# EAGLE schematic 2_auto (EAGLE 5.10)
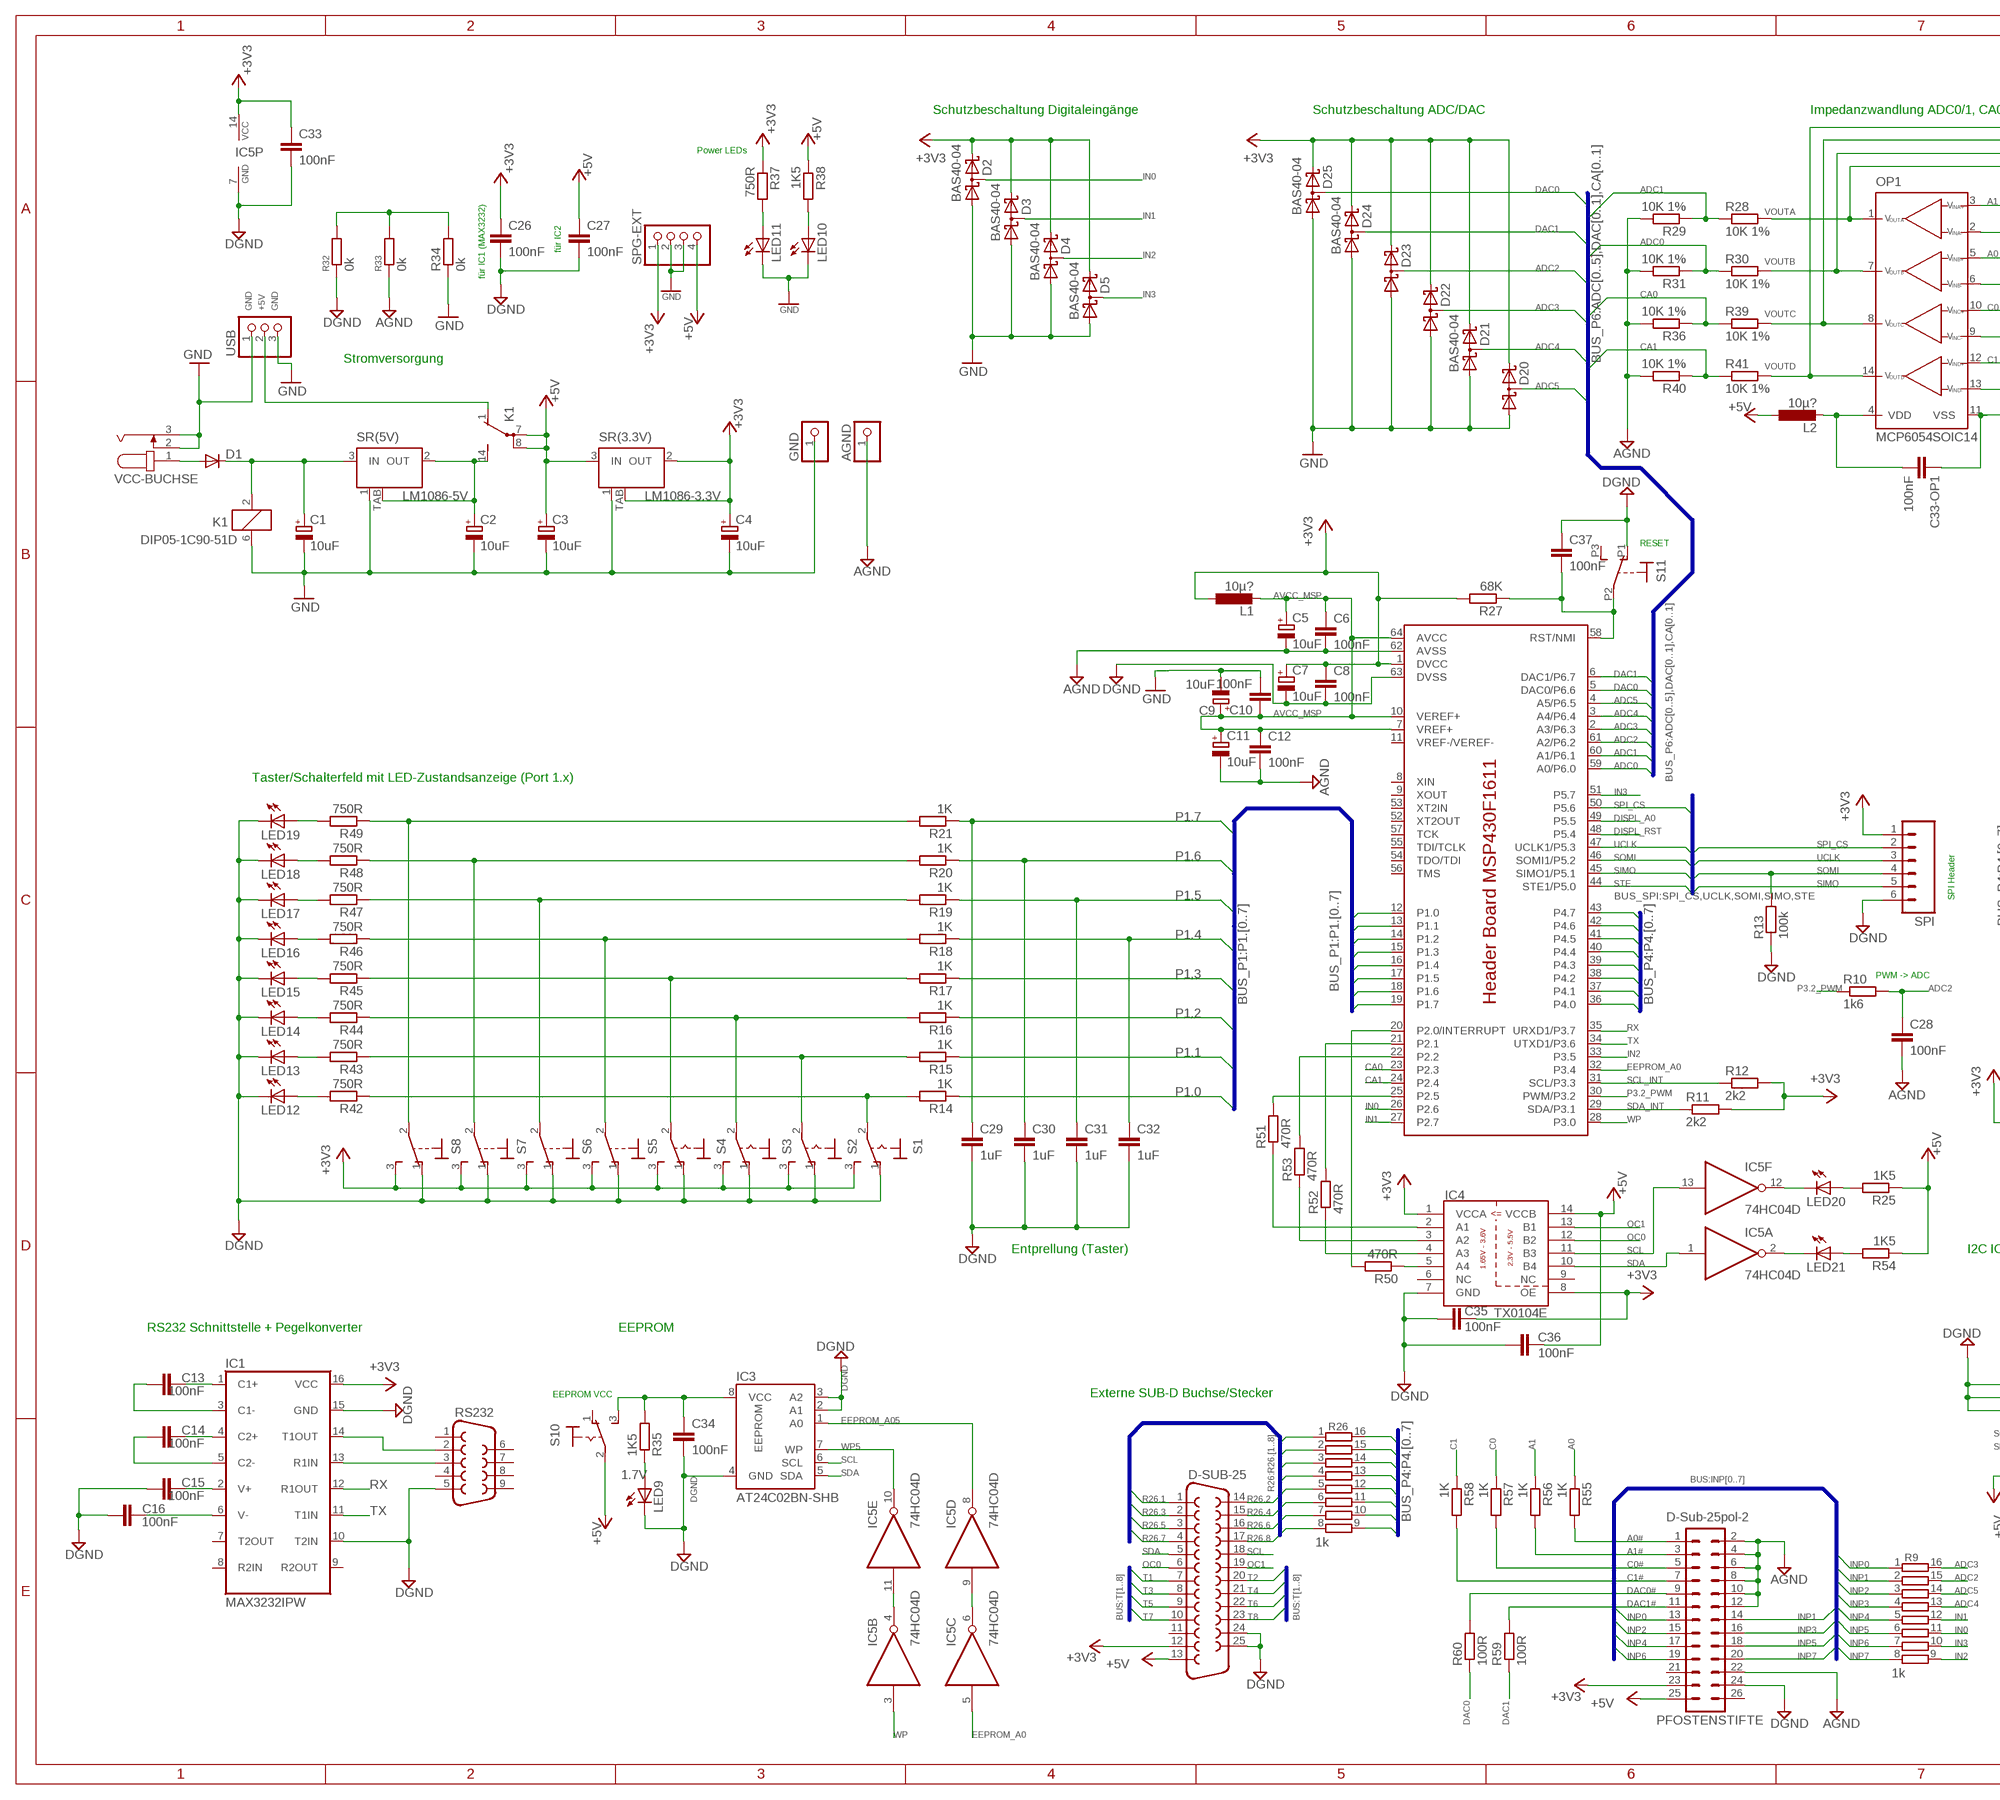
[diagram p0: schematic, sheet 1, part 1 of 2]
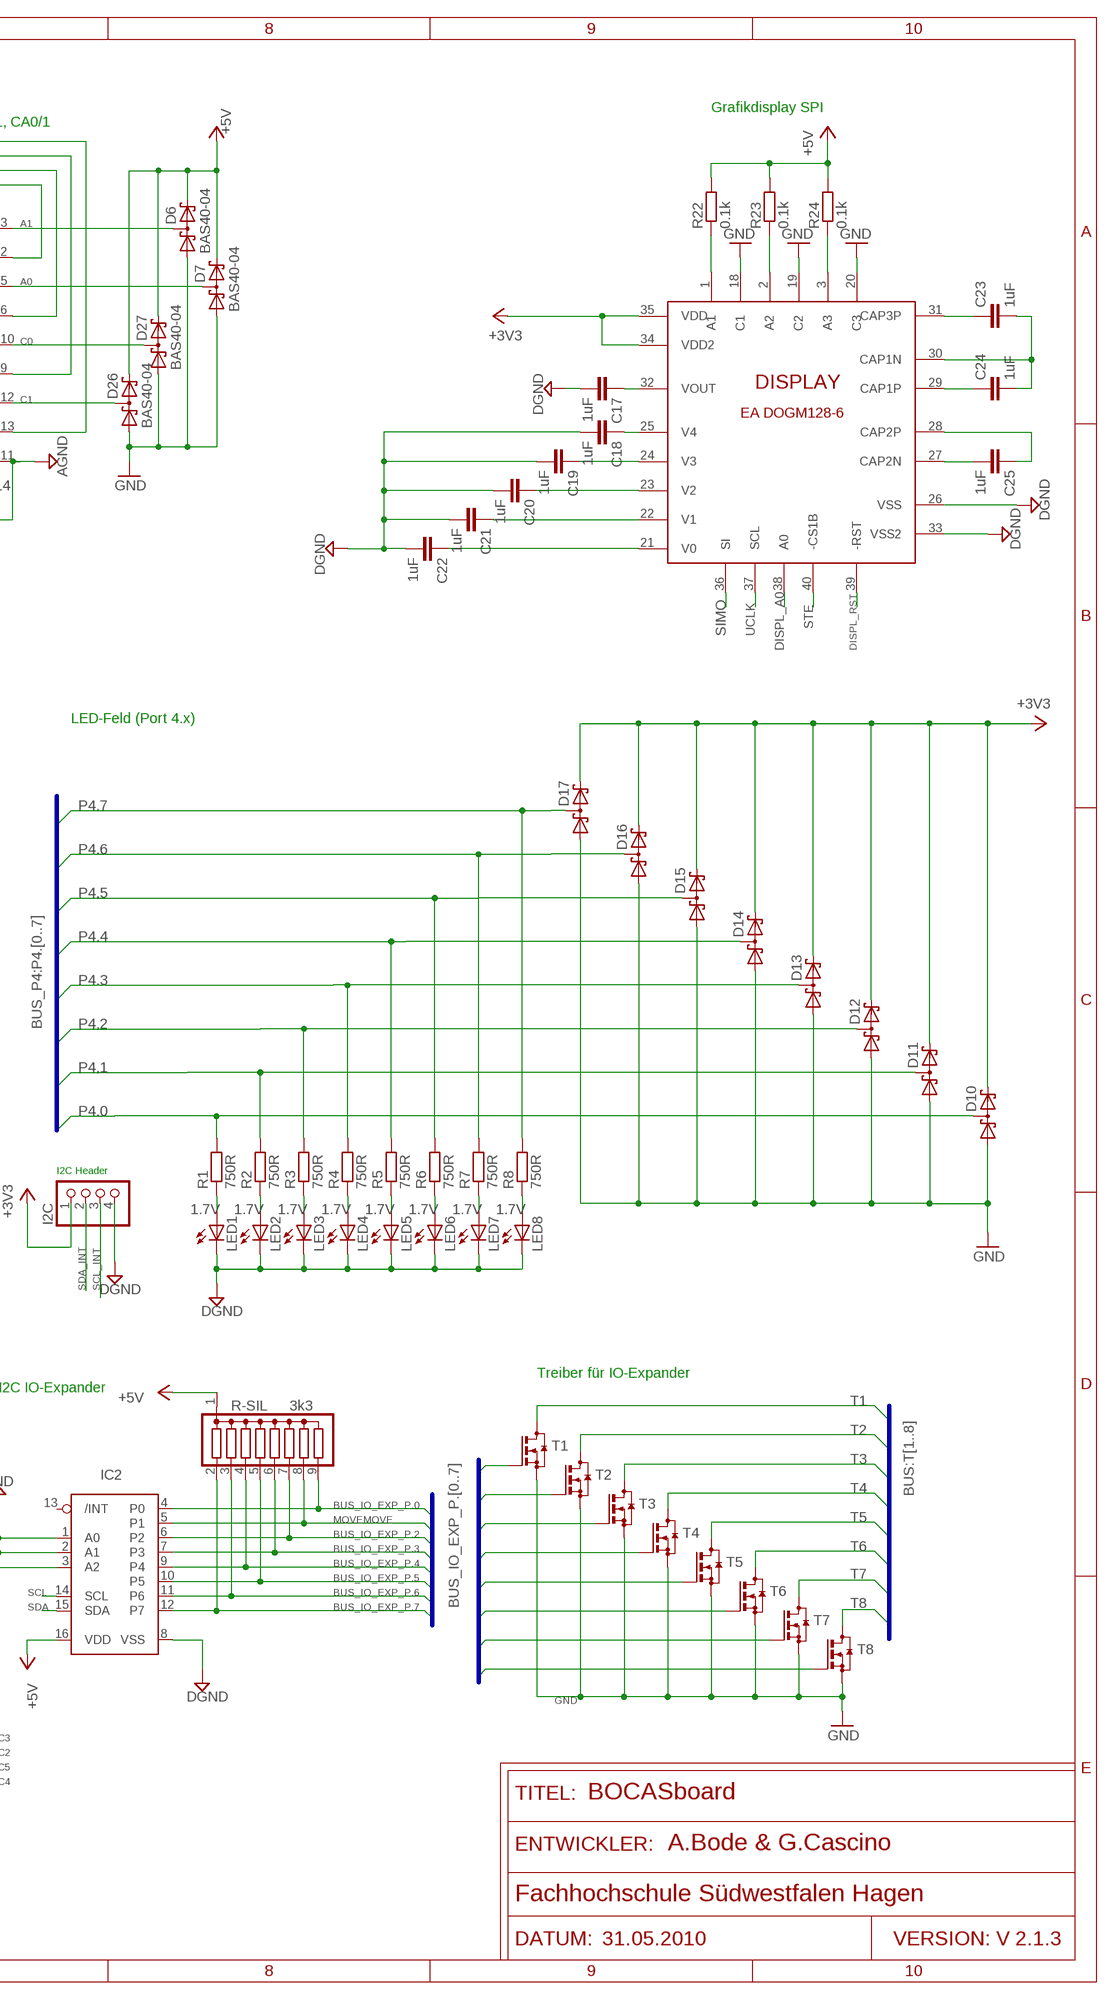
[diagram p1: schematic, sheet 1, part 2 of 2]

## Parts
AGND  PINHD-1X1  [1X01]
C1  10uF  KONDENSATORENCT3216  [CT3216]
C2  10uF  KONDENSATORENCT3216  [CT3216]
C3  10uF  KONDENSATORENCT3216  [CT3216]
C4  10uF  KONDENSATORENCT3216  [CT3216]
C5  10uF  KONDENSATORENCT3216  [CT3216]
C6  100nF  KONDENSATOR-  [R0805]
C7  10uF  KONDENSATORENCT3216  [CT3216]
C8  100nF  KONDENSATOR-  [R0805]
C9  10uF  KONDENSATORENCT3216  [CT3216]
C10  100nF  KONDENSATOR-  [R0805]
C11  10uF  KONDENSATORENCT3216  [CT3216]
C12  100nF  KONDENSATOR-  [R0805]
C13  100nF  KONDENSATOREN-KERAMIK  [C0805]
C14  100nF  KONDENSATOREN-KERAMIK  [C0805]
C15  100nF  KONDENSATOREN-KERAMIK  [C0805]
C16  100nF  KONDENSATOREN-KERAMIK  [C0805]
C17  1uF  KONDENSATOREN-KERAMIK  [C0805]
C18  1uF  KONDENSATOREN-KERAMIK  [C0805]
C19  1uF  KONDENSATOREN-KERAMIK  [C0805]
C20  1uF  KONDENSATOREN-KERAMIK  [C0805]
C21  1uF  KONDENSATOREN-KERAMIK  [C0805]
C22  1uF  KONDENSATOREN-KERAMIK  [C0805]
C23  1uF  KONDENSATOREN-KERAMIK  [C0805]
C24  1uF  KONDENSATOREN-KERAMIK  [C0805]
C25  1uF  KONDENSATOREN-KERAMIK  [C0805]
C26  100nF  KONDENSATOREN-KERAMIK  [C0805]
C27  100nF  KONDENSATOREN-KERAMIK  [C0805]
C28  100nF  KONDENSATOREN-KERAMIK  [C0805]
C29  1uF  KONDENSATOREN-KERAMIK  [C0805]
C30  1uF  KONDENSATOREN-KERAMIK  [C0805]
C31  1uF  KONDENSATOREN-KERAMIK  [C0805]
C32  1uF  KONDENSATOREN-KERAMIK  [C0805]
C33  100nF  KONDENSATOREN-KERAMIK  [C0805]
C33-OP1  100nF  KONDENSATOREN-KERAMIK  [C0805]
C34  100nF  KONDENSATOREN-KERAMIK  [C0805]
C35  100nF  KONDENSATOREN-KERAMIK  [C0805]
C36  100nF  KONDENSATOREN-KERAMIK  [C0805]
C37  100nF  KONDENSATOR-  [R0805]
D1  ES2D  [SMB]
D2  BAS40-04  [SOT23]
D3  BAS40-04  [SOT23]
D4  BAS40-04  [SOT23]
D5  BAS40-04  [SOT23]
D6  BAS40-04  [SOT23]
D7  BAS40-04  [SOT23]
D10  BAS40-04  [SOT23]
D11  BAS40-04  [SOT23]
D12  BAS40-04  [SOT23]
D13  BAS40-04  [SOT23]
D14  BAS40-04  [SOT23]
D15  BAS40-04  [SOT23]
D16  BAS40-04  [SOT23]
D17  BAS40-04  [SOT23]
D20  BAS40-04  [SOT23]
D21  BAS40-04  [SOT23]
D22  BAS40-04  [SOT23]
D23  BAS40-04  [SOT23]
D24  BAS40-04  [SOT23]
D25  BAS40-04  [SOT23]
D26  BAS40-04  [SOT23]
D27  BAS40-04  [SOT23]
D-SUB-25  D-SUB-25H  [F25-HORIZONTAL_2]
DISPLAY  EADOGM128  [EADOGM128]
GND  PINHD-1X1  [1X01]
I2C  PINHD-1X4  [1X04]
IC1  MAX3232IPW  [TSSOP16]
IC2  PCF8574AT  [SO16L]
IC3  AT24C02BN-SHB  [SOIC8]
IC4  TX0104E  TX0104PWR  [TSSOP14]
IC5  74HC04D  [SO14]
K1  DIP05-1C90-51D  [RR1U]
L1  10µ?  L-EUL0805  [R0805]
L2  10µ?  L-EUL0805  [R0805]
LED1  1.7V  LED3MM  [LED3MM]
LED2  1.7V  LED3MM  [LED3MM]
LED3  1.7V  LED3MM  [LED3MM]
LED4  1.7V  LED3MM  [LED3MM]
LED5  1.7V  LED3MM  [LED3MM]
LED6  1.7V  LED3MM  [LED3MM]
LED7  1.7V  LED3MM  [LED3MM]
LED8  1.7V  LED3MM  [LED3MM]
LED9  1.7V  LED3MM  [LED3MM]
LED10  LED  [R0805]
LED11  LED  [R0805]
LED12  LED  [R0805]
LED13  LED  [R0805]
LED14  LED  [R0805]
LED15  LED  [R0805]
LED16  LED  [R0805]
LED17  LED  [R0805]
LED18  LED  [R0805]
LED19  LED  [R0805]
LED20  LED  [R0805]
LED21  LED  [R0805]
OP1  MCP6054SOIC14  [SO14]
PFOSTENSTIFTE  D-Sub-25pol-2  PFOSTENSTIFTE  [ML26]
R1  750R  WIDERSTÄNDE_R0805  [R0805]
R2  750R  WIDERSTÄNDE_R0805  [R0805]
R3  750R  WIDERSTÄNDE_R0805  [R0805]
R4  750R  WIDERSTÄNDE_R0805  [R0805]
R5  750R  WIDERSTÄNDE_R0805  [R0805]
R6  750R  WIDERSTÄNDE_R0805  [R0805]
R7  750R  WIDERSTÄNDE_R0805  [R0805]
R8  750R  WIDERSTÄNDE_R0805  [R0805]
R9  1k  4816P-NETF  [SO16-F]
R10  1k6  WIDERSTÄNDE_R0805  [R0805]
R11  2k2  WIDERSTÄNDE_R0805  [R0805]
R12  2k2  WIDERSTÄNDE_R0805  [R0805]
R13  100k  WIDERSTÄNDE_R0805  [R0805]
R14  1K  WIDERSTÄNDE_R0805  [R0805]
R15  1K  WIDERSTÄNDE_R0805  [R0805]
R16  1K  WIDERSTÄNDE_R0805  [R0805]
R17  1K  WIDERSTÄNDE_R0805  [R0805]
R18  1K  WIDERSTÄNDE_R0805  [R0805]
R19  1K  WIDERSTÄNDE_R0805  [R0805]
R20  1K  WIDERSTÄNDE_R0805  [R0805]
R21  1K  WIDERSTÄNDE_R0805  [R0805]
R22  0.1k  WIDERSTÄNDE_R0805  [R0805]
R23  0.1k  WIDERSTÄNDE_R0805  [R0805]
R24  0.1k  WIDERSTÄNDE_R0805  [R0805]
R25  1K5  WIDERSTÄNDE_R0805  [R0805]
R26  1k  4816P-NETF  [SO16-F]
R27  68K  WIDERSTÄNDE_M0805  [M0805]
R28  10K 1%  WIDERSTÄNDE_R0805  [R0805]
R29  10K 1%  WIDERSTÄNDE_R0805  [R0805]
R30  10K 1%  WIDERSTÄNDE_R0805  [R0805]
R31  10K 1%  WIDERSTÄNDE_R0805  [R0805]
R32  0k  WIDERSTÄNDE_R0805  [R0805]
R33  0k  WIDERSTÄNDE_R0805  [R0805]
R34  0k  WIDERSTÄNDE_R0805  [R0805]
R35  1K5  WIDERSTÄNDE_R0805  [R0805]
R36  10K 1%  WIDERSTÄNDE_R0805  [R0805]
R37  750R  WIDERSTÄNDE_M0805  [M0805]
R38  1K5  WIDERSTÄNDE_M0805  [M0805]
R39  10K 1%  WIDERSTÄNDE_R0805  [R0805]
R40  10K 1%  WIDERSTÄNDE_R0805  [R0805]
R41  10K 1%  WIDERSTÄNDE_R0805  [R0805]
R42  750R  WIDERSTÄNDE_R0805  [R0805]
R43  750R  WIDERSTÄNDE_R0805  [R0805]
R44  750R  WIDERSTÄNDE_R0805  [R0805]
R45  750R  WIDERSTÄNDE_R0805  [R0805]
R46  750R  WIDERSTÄNDE_R0805  [R0805]
R47  750R  WIDERSTÄNDE_R0805  [R0805]
R48  750R  WIDERSTÄNDE_R0805  [R0805]
R49  750R  WIDERSTÄNDE_R0805  [R0805]
R50  470R  WIDERSTÄNDE_R0805  [R0805]
R51  470R  WIDERSTÄNDE_R0805  [R0805]
R52  470R  WIDERSTÄNDE_R0805  [R0805]
R53  470R  WIDERSTÄNDE_R0805  [R0805]
R54  1K5  WIDERSTÄNDE_R0805  [R0805]
R55  1K  WIDERSTÄNDE_R0805  [R0805]
R56  1K  WIDERSTÄNDE_R0805  [R0805]
R57  1K  WIDERSTÄNDE_R0805  [R0805]
R58  1K  WIDERSTÄNDE_R0805  [R0805]
R59  100R  WIDERSTÄNDE_R0805  [R0805]
R60  100R  WIDERSTÄNDE_R0805  [R0805]
R-SIL  3k3  BOURNS-4609  [SIL9]
RS232  D-SUB-09H  [F09-H1]
S1  KIPPSCHALTER  [2MS]
S2  KIPPSCHALTER  [2MS]
S3  KIPPSCHALTER  [2MS]
S4  KIPPSCHALTER  [2MS]
S5  KIPPTASTER  [2MS]
S6  KIPPTASTER  [2MS]
S7  KIPPTASTER  [2MS]
S8  KIPPTASTER  [2MS]
S10  KIPPSCHALTER  [2MS]
S11  RESET-KIPPTASTER  [KIPPTASTER-90]
SPG-EXT  PINHD-1X4  [1X04]
SPI  PFOSTENSTECKER-P06  [PFOSTENSTECKER-P06]
SR(3.3V)  LM1086-3.3V  [TO263-3]
SR(5V)  LM1086-5V  [TO263-3]
T1  N-MOSFET  [SOT346]
T2  N-MOSFET  [SOT346]
T3  N-MOSFET  [SOT346]
T4  N-MOSFET  [SOT346]
T5  N-MOSFET  [SOT346]
T6  N-MOSFET  [SOT346]
T7  N-MOSFET  [SOT346]
T8  N-MOSFET  [SOT346]
U$1  HEADER_BOARD_2  [MCKU]
USB  PINHD-1X3  [1X03]
VCC-BUCHSE  VCC-BUCHSE0  [VCC-BUCHSE-MULTIOCOMP]

## Nets
+3V3 [VCC +3.3V]: C4.+ C7.+ C8.1 C26.1 C33.1 C35.1 D2.2(C2) D3.2(C2) D4.2(C2) D5.2(C2) D10.2(C2) D11.2(C2) D12.2(C2) D13.2(C2) D14.2(C2) D15.2(C2) D16.2(C2) D17.2(C2) D20.2(C2) D21.2(C2) D22.2(C2) D23.2(C2) D24.2(C2) D25.2(C2) D-SUB-25.12 DISPLAY.34(VDD2) DISPLAY.35(VDD) I2C.1 IC1.16(VCC) IC4.1(VCCA) IC4.8(OE) IC5.14(P:VCC) L1.1 PFOSTENSTIFTE.23 R11.2 R12.2 R27.2 R37.1 S1.3 S2.3 S3.3 S4.3 S5.3 S6.3 S7.3 S8.3 SPG-EXT.1 SPI.1 SR(3.3V).2(OUT) SR(3.3V).TAB(OUT) U$1.1(DVCC)
+5V [Power]: C3.+ C27.1 C36.1 D6.2(C2) D7.2(C2) D26.2(C2) D27.2(C2) D-SUB-25.13 IC2.16(VDD) IC4.14(VCCB) K1.7(2:P) K1.8(2:P) L2.1 PFOSTENSTIFTE.25 R22.2 R23.2 R24.2 R25.1 R38.1 R54.1 R-SIL.1 S10.2 SPG-EXT.4 SR(3.3V).3(IN)
A0 [Analog]: D7.3(C1A2) OP1.5(VINB+) R55.1
A0# [Analog]: PFOSTENSTIFTE.1 R55.2
A1 [Analog]: D6.3(C1A2) OP1.3(VINA+) R56.1
A1# [Analog]: PFOSTENSTIFTE.3 R56.2
A2_TX: IC4.4(A3) R52.1
A3_TX: IC4.3(A2) R53.1
A4_TX: IC4.2(A1) R51.1
ADC0: R30.1 R31.1 U$1.59(A0/P6.0)
ADC1: R28.1 R29.1 U$1.60(A1/P6.1)
ADC2 [Analog]: C28.1 D23.3(C1A2) R9.15 R10.2 U$1.61(A2/P6.2)
ADC3 [Analog]: D22.3(C1A2) R9.16 U$1.2(A3/P6.3)
ADC4 [Analog]: D21.3(C1A2) R9.13 U$1.3(A4/P6.4)
ADC5 [Analog]: D20.3(C1A2) R9.14 U$1.4(A5/P6.5)
AGND [Power]: AGND.1 C5.- C6.2 C11.- C12.2 C28.2 C33-OP1.1 OP1.11(VSS) PFOSTENSTIFTE.2 PFOSTENSTIFTE.4 PFOSTENSTIFTE.6 PFOSTENSTIFTE.8 PFOSTENSTIFTE.10 PFOSTENSTIFTE.12 PFOSTENSTIFTE.22 R29.2 R31.2 R33.1 R36.2 R40.2 U$1.62(AVSS)
AVCC_MSP [VCC +3.3V]: C5.+ C6.1 C9.+ C10.1 C11.+ C12.1 L1.2 U$1.7(VREF+) U$1.10(VEREF+) U$1.64(AVCC)
BUS_IO_EXP_P.0 [Digital]: IC2.4(P0) R-SIL.9 T1.1(G)
BUS_IO_EXP_P.2 [Digital]: IC2.6(P2) R-SIL.7 T3.1(G)
BUS_IO_EXP_P.3 [Digital]: IC2.7(P3) R-SIL.6 T4.1(G)
BUS_IO_EXP_P.4 [Digital]: IC2.9(P4) R-SIL.4 T5.1(G)
BUS_IO_EXP_P.5 [Digital]: IC2.10(P5) R-SIL.5 T6.1(G)
BUS_IO_EXP_P.6: IC2.11(P6) R-SIL.3 T7.1(G)
BUS_IO_EXP_P.7 [Digital]: IC2.12(P7) R-SIL.2 T8.1(G)
C0: D27.3(C1A2) OP1.10(VINC+) R57.1
C0#: PFOSTENSTIFTE.5 R57.2
C1: D26.3(C1A2) OP1.12(VIND+) R58.1
C1#: PFOSTENSTIFTE.7 R58.2
C1+: C13.2 IC1.1(C1+)
C1-: C13.1 IC1.3(C1-)
C2+: C14.2 IC1.4(C2+)
CA0: R36.1 R39.1 U$1.23(P2.3)
CA1: R40.1 R41.1 U$1.24(P2.4)
DAC0: D25.3(C1A2) R60.1 U$1.5(DAC0/P6.6)
DAC0#: PFOSTENSTIFTE.9 R60.2
DAC1: D24.3(C1A2) R59.1 U$1.6(DAC1/P6.7)
DAC1#: PFOSTENSTIFTE.11 R59.2
DGND [Digital]: C7.- C8.2 C15.1 C16.1 C17.2 C18.2 C19.2 C20.2 C21.2 C22.2 C26.2 C27.2 C29.2 C30.2 C31.2 C32.2 C33.2 C34.2 C35.2 C36.2 C37.1 D-SUB-25.24 D-SUB-25.25 DISPLAY.26(VSS) DISPLAY.33(VSS2) I2C.4 IC1.10(T2IN) IC1.15(GND) IC2.1(A0) IC2.2(A1) IC2.3(A2) IC2.8(VSS) IC3.2(A1) IC3.3(A2) IC3.4(GND) IC4.7(GND) IC5.7(P:GND) LED1.K LED2.K LED3.K LED4.K LED5.K LED6.K LED7.K LED8.K LED9.K LED12.2(K) LED13.2(K) LED14.2(K) LED15.2(K) LED16.2(K) LED17.2(K) LED18.2(K) LED19.2(K) PFOSTENSTIFTE.24 R13.1 R32.1 RS232.5 S1.1 S2.1 S3.1 S4.1 S5.1 S6.1 S7.1 S8.1 S11.P1 SPI.6 U$1.63(DVSS)
DISPL_A0 [Digital]: DISPLAY.38(A0) U$1.49(P5.5)
DISPL_RST [Digital]: DISPLAY.39(-RST) U$1.48(P5.4)
EEPROM_A0 [Digital]: IC5.5(C:I) U$1.32(P3.4)
EEPROM_A05 [Digital]: IC3.1(A0) IC5.8(D:O)
GND [High Strom]: C1.- C2.- C3.- C4.- C9.- C10.2 D2.1(A1) D3.1(A1) D4.1(A1) D5.1(A1) D6.1(A1) D7.1(A1) D10.1(A1) D11.1(A1) D12.1(A1) D13.1(A1) D14.1(A1) D15.1(A1) D16.1(A1) D17.1(A1) D20.1(A1) D21.1(A1) D22.1(A1) D23.1(A1) D24.1(A1) D25.1(A1) D26.1(A1) D27.1(A1) DISPLAY.18(C1) DISPLAY.19(C2) DISPLAY.20(C3) GND.1 K1.6 LED10.2(K) LED11.2(K) R34.1 SPG-EXT.2 SPG-EXT.3 SR(3.3V).1(GND) SR(5V).1(GND) T1.2(S) T2.2(S) T3.2(S) T4.2(S) T5.2(S) T6.2(S) T7.2(S) T8.2(S) USB.1 USB.3 VCC-BUCHSE.2 VCC-BUCHSE.3
IN0: D2.3(C1A2) R9.11 U$1.26(P2.6)
IN1: D3.3(C1A2) R9.12 U$1.27(P2.7)
IN2: D4.3(C1A2) R9.9 U$1.33(P3.5)
IN3: D5.3(C1A2) R9.10 U$1.51(P5.7)
INP0: PFOSTENSTIFTE.13 R9.1
INP1: PFOSTENSTIFTE.14 R9.2
INP2: PFOSTENSTIFTE.15 R9.3
INP3: PFOSTENSTIFTE.16 R9.4
INP4: PFOSTENSTIFTE.17 R9.5
INP5: PFOSTENSTIFTE.18 R9.6
INP6: PFOSTENSTIFTE.19 R9.7
INP7: PFOSTENSTIFTE.20 R9.8
MOVEMOVE [Digital]: IC2.5(P1) R-SIL.8 T2.1(G)
N$1: DISPLAY.1(A1) R22.1
N$2: R14.2 R42.1 S1.2
N$3: LED12.1(A) R42.2
N$4: DISPLAY.2(A2) R23.1
N$5: R50.2 U$1.20(P2.0/INTERRUPT)
N$6: LED19.1(A) R49.2
N$7: DISPLAY.3(A3) R24.1
N$8: LED18.1(A) R48.2
N$9: C23.1 DISPLAY.31(CAP3P)
N$10: LED17.1(A) R47.2
N$11: LED11.1(A) R37.2
N$12: LED10.1(A) R38.2
N$13: LED16.1(A) R46.2
N$14: LED15.1(A) R45.2
N$15: LED14.1(A) R44.2
N$16: C14.1 IC1.5(C2-)
N$17: D1.A VCC-BUCHSE.1
N$18: LED13.1(A) R43.2
N$19: R21.2 R49.1 S8.2
N$20: R20.2 R48.1 S7.2
N$21: R19.2 R47.1 S6.2
N$22: R18.2 R46.1 S5.2
N$23: C22.1 DISPLAY.21(V0)
N$24: C21.1 DISPLAY.22(V1)
N$25: C20.1 DISPLAY.23(V2)
N$26: C19.1 DISPLAY.24(V3)
N$27: LED1.A R1.1
N$28: LED2.A R2.1
N$29: LED3.A R3.1
N$30: LED4.A R4.1
N$31: LED5.A R5.1
N$32: LED6.A R6.1
N$33: LED7.A R7.1
N$34: LED8.A R8.1
N$35: C17.1 DISPLAY.32(VOUT)
N$36: C18.1 DISPLAY.25(V4)
N$37: C24.1 DISPLAY.29(CAP1P)
N$38: C23.2 C24.2 DISPLAY.30(CAP1N)
N$39: C25.2 DISPLAY.27(CAP2N)
N$40: C25.1 DISPLAY.28(CAP2P)
N$41: R17.2 R45.1 S4.2
N$42: R32.2 R33.2 R34.2
N$43: LED9.A R35.1
N$44: R16.2 R44.1 S3.2
N$45: R15.2 R43.1 S2.2
N$46: R52.2 U$1.21(P2.1)
N$47: IC4.5(A4) R50.1
N$48: R51.2 U$1.25(P2.5)
N$50: C15.2 IC1.2(V+)
N$51 [Power]: C33-OP1.2 L2.2 OP1.4(VDD)
N$53: R53.2 U$1.22(P2.2)
N$55: IC5.12(F:O) LED20.2(K)
N$56: IC5.2(A:O) LED21.2(K)
N$57: LED21.1(A) R54.2
N$58: LED20.1(A) R25.2
N$59: IC5.6(C:O) IC5.9(D:I)
N$61: IC5.4(B:O) IC5.11(E:I)
OC0: D-SUB-25.6 IC4.12(B2)
OC1: D-SUB-25.19 IC4.13(B1)
OUT+5V [Power]: C2.+ K1.14(2:S) SR(5V).2(OUT) SR(5V).TAB(OUT)
P1.0 [Digital]: R14.1 U$1.12(P1.0)
P1.1 [Digital]: R15.1 U$1.13(P1.1)
P1.2 [Digital]: R16.1 U$1.14(P1.2)
P1.3 [Digital]: R17.1 U$1.15(P1.3)
P1.4 [Digital]: C32.1 R18.1 U$1.16(P1.4)
P1.5 [Digital]: C31.1 R19.1 U$1.17(P1.5)
P1.6 [Digital]: C30.1 R20.1 U$1.18(P1.6)
P1.7 [Digital]: C29.1 R21.1 U$1.19(P1.7)
P3.2_PWM [Digital]: R10.1 U$1.30(PWM/P3.2)
P4.0 [Digital]: D10.3(C1A2) R1.2 R26.16 U$1.36(P4.0)
P4.1 [Digital]: D11.3(C1A2) R2.2 R26.15 U$1.37(P4.1)
P4.2 [Digital]: D12.3(C1A2) R3.2 R26.14 U$1.38(P4.2)
P4.3 [Digital]: D13.3(C1A2) R4.2 R26.13 U$1.39(P4.3)
P4.4 [Digital]: D14.3(C1A2) R5.2 R26.12 U$1.40(P4.4)
P4.5 [Digital]: D15.3(C1A2) R6.2 R26.11 U$1.41(P4.5)
P4.6 [Digital]: D16.3(C1A2) R7.2 R26.10 U$1.42(P4.6)
P4.7 [Digital]: D17.3(C1A2) R8.2 R26.9 U$1.43(P4.7)
PWR-5 [Power]: C1.+ D1.C K1.2 SR(5V).3(IN)
R1IN [Digital]: IC1.13(R1IN) RS232.3
R26.1: D-SUB-25.1 R26.1
R26.2: D-SUB-25.14 R26.2
R26.3: D-SUB-25.2 R26.3
R26.4: D-SUB-25.15 R26.4
R26.5: D-SUB-25.3 R26.5
R26.6: D-SUB-25.16 R26.6
R26.7: D-SUB-25.4 R26.7
R26.8: D-SUB-25.17 R26.8
RX [Digital]: IC1.12(R1OUT) U$1.35(URXD1/P3.7)
S10: C37.2 R27.1 S11.P2 U$1.58(RST/NMI)
SCL [Digital]: D-SUB-25.18 IC2.14(SCL) IC3.6(SCL) IC4.11(B3) IC5.13(F:I)
SCL_INT [Digital]: I2C.3 R12.1 U$1.31(SCL/P3.3)
SDA [Digital]: D-SUB-25.5 IC2.15(SDA) IC3.5(SDA) IC4.10(B4) IC5.1(A:I)
SDA_INT [Digital]: I2C.2 R11.1 U$1.29(SDA/P3.1)
SIMO: DISPLAY.36(SI) SPI.5 U$1.45(SIMO1/P5.1)
SOMI: R13.2 SPI.4 U$1.46(SOMI1/P5.2)
SPI_CS: SPI.2 U$1.50(P5.6)
STE: DISPLAY.40(-CS1B) U$1.44(STE1/P5.0)
T1 [High Strom]: D-SUB-25.7 T1.3(D)
T1OUT [Digital]: IC1.14(T1OUT) RS232.2
T2 [High Strom]: D-SUB-25.20 T2.3(D)
T3 [High Strom]: D-SUB-25.8 T3.3(D)
T4 [High Strom]: D-SUB-25.21 T4.3(D)
T5 [High Strom]: D-SUB-25.9 T5.3(D)
T6 [High Strom]: D-SUB-25.22 T6.3(D)
T7 [High Strom]: D-SUB-25.10 T7.3(D)
T8 [High Strom]: D-SUB-25.23 T8.3(D)
TX [Digital]: IC1.11(T1IN) U$1.34(UTXD1/P3.6)
UCLK: DISPLAY.37(SCL) SPI.3 U$1.47(UCLK1/P5.3)
USB [Power]: K1.1(2:O) USB.2
V-: C16.2 IC1.6(V-)
VCC-EEPROM [Digital]: C34.1 IC3.8(VCC) R35.2 S10.3
VOUTA: OP1.1(VOUTA) OP1.2(VINA-) R28.2
VOUTB: OP1.6(VINB-) OP1.7(VOUTB) R30.2
VOUTC: OP1.8(VOUTC) OP1.9(VINC-) R39.2
VOUTD: OP1.13(VIND-) OP1.14(VOUTD) R41.2
WP [Digital]: IC5.3(B:I) U$1.28(P3.0)
WP5 [Digital]: IC3.7(WP) IC5.10(E:O)
Unconnected: D-SUB-25.11 IC1.7(T2OUT) IC1.8(R2IN) IC1.9(R2OUT) IC2.13(/INT) IC4.6(NC) IC4.9(NC) PFOSTENSTIFTE.21 PFOSTENSTIFTE.26 RS232.1 RS232.4 RS232.6 RS232.7 RS232.8 RS232.9 S10.1 S11.P3 U$1.8(XIN) U$1.9(XOUT) U$1.11(VREF-/VEREF-) U$1.52(XT2OUT) U$1.53(XT2IN) U$1.54(TDO/TDI) U$1.55(TDI/TCLK) U$1.56(TMS) U$1.57(TCK)

## Buses
BUS_P1:P1.[0..7]
BUS_IO_EXP_P.[0..7]
BUS_SPI:SPI_CS,UCLK,SOMI,SIMO,STE
BUS:T[1..8]
R26:R26.[1..8]
BUS_P4:P4.[0..7]
BUS_P6:ADC[0..5],DAC[0..1],CA[0..1]
BUS:INP[0..7]

## Notes on the sheet
- Grafikdisplay SPI
- Schutzbeschaltung Digitaleingänge | Schutzbeschaltung ADC/DAC | Impedanzwandlung ADC0/1, CA0/1
- Power LEDs
- für IC2
- für IC1 (MAX3232)
- GND | +5V | GND
- Stromversorgung
- RESET
- LED-Feld (Port 4.x)
- Taster/Schalterfeld mit LED-Zustandsanzeige (Port 1.x)
- SPI Header
- PWM -> ADC
- I2C Header
- Treiber für IO-Expander
- Entprellung (Taster) | I2C IO-Expander
- RS232 Schnittstelle + Pegelkonverter | EEPROM
- EEPROM VCC | Externe SUB-D Buchse/Stecker
- EEPROM
- TITEL: | BOCASboard
- ENTWICKLER: | A.Bode & G.Cascino
- Fachhochschule Südwestfalen Hagen
- DATUM: | 31.05.2010 | VERSION: V 2.1.3

## Library data of the parts
AGND GND = Projekt:PINHD-1X1: PIN HEADER
C1-C5 C7 C9 C11 = Projekt:KONDENSATOREN: POLARIZED CAPACITOR, European symbol
C6 C8 C10 C12 C37 = Projekt:KONDENSATOR-: CAPACITOR, European symbol
C13-C33 C33-OP1 C34-C36 = Projekt:KONDENSATOREN-KERAMIK: Keramik Kondensator,
D1 = Projekt:ES2D: DIODE super fast rectifier, 2 A
D2-D7 D10-D17 D20-D27 = Projekt:BAS40-04: Silicon Schottky Diodes General-purpose diode for high-speed switching
D-SUB-25 = Projekt:D-SUB-25H: Multicomp 5504F1 - Series
DISPLAY = Projekt:EADOGM128
I2C SPG-EXT = Projekt:PINHD-1X4: PIN HEADER
IC1 = Projekt:MAX3232: Texas Instruments RS-232 Transceivers Supply-Current, True +3V to +5.5V
IC2 = Projekt:PCF8574: Remote 8-Bit I/O Expander for I²C Bus
IC3 = Projekt:AT24C*: 2-wire serial EEPROM
IC4 = Projekt:TX0104: TXB0104 or TXS0104 TXB0104 4-BIT BIDIRECTIONAL VOLTAGE-LEVEL TRANSLATOR WITH AUTOMATIC DIRECTION SENSING AND ±15-kV ESD PROTECTION FEATURES 1.2 V to 3.6 V on A Port and 1.65 V to 5.5 V on B Port (VCCA <= VCCB) VCC Isolation Feature - If Either VCC Input Is at GND, All Outputs Are in the High-Impedance State OE Input Circuit Referenced to VCCA Low Power Consumption, 5-uA Max ICC Ioff Supports Partial-Power-Down Mode Operation TXS0104 4-BIT BIDIRECTIONAL VOLTAGE-LEVEL TRANSLATOR FOR OPEN-DRAIN AND PUSH-PULL APPLICATIONS
IC5 = 74xx-eu:74*04: Hex INVERTER
K1 = Projekt:DIP05: REED-RELAY Meder Reed, 1 x Wechselkontakt
L1 L2 = Projekt:L-EU: INDUCTOR, European symbol
LED1-LED21 = Projekt:LED: LED OSRAM: KINGBRIGHT: L-934LSRD 3mm Source: www.kingbright.com
OP1 = Projekt:MCP6054: Operationsverstärker Microchip MCP 6052
PFOSTENSTIFTE = Projekt:PFOSTENSTIFTE: Pfostenstifte
R1-R8 R10-R25 R27-R60 = Projekt:WIDERSTÄNDE_: RESISTOR, European symbol
R9 R26 = Projekt:4816P-NET: BOURNS RESISTOR NETWORK
R-SIL = Projekt:BOURNS-: BOURNS 4609X-SIL Widerstand
RS232 = Projekt:D-SUB-09H
S1-S4 S10 = Projekt:KIPPSCHALTER: MULTICOMP SWITCH Kippschalter ein-ein
S5-S8 = Projekt:KIPPTASTER: MULTICOMP SWITCH Kipptaster ein-tast
S11 = Projekt:RESET-KIPPTASTER: Multicomp Kipptaster gewinkelt, ein-tast
SPI = Projekt:PFOSTENSTECKER-P06
SR(3.3V) = Projekt:LM1086-3.3V: National Semiconductor LM1086-3.3V 1.5A Low Dropout Positive Regulators
SR(5V) = Projekt:LM1086-5V: National Semiconductor LM1086-5V 1.5A Low Dropout Positive Regulators
T1-T8 = Projekt:N-MOSFET: Sanyo CPH3430 N-CHANNEL MOSFET
U$1 = Projekt:HEADER_BOARD_2: Texas Instruments MSP430F1611
USB = Projekt:PINHD-1X3: PIN HEADER
VCC-BUCHSE = Projekt:VCC-BUCHSE: DC Buchse 2.35mm Multicomp

## Net classes
1 Power: width 0.61 mm, drill 0.406 mm, clearance 0.203 mm
2 High Strom: width 1.016 mm, drill 0.508 mm, clearance 0.203 mm
3 Digital: width 0.152 mm, drill 0.305 mm, clearance 0.152 mm
4 Analog: width 0.508 mm, drill 0.305 mm, clearance 0.203 mm
5 VCC +3.3V: width 0.406 mm, drill 0.305 mm, clearance 0.203 mm